# Altium schematic sheet Encoder_Interface.SchDoc
size A4; CompanyName: Technische Hochschule Nürnberg Georg Simon Ohm; Organization: UltraZohm; Address1: Kesslerplatz 12; Address2: 90489 Nürnberg; Address3: GERMANY; Website: www.ultrazohm.com
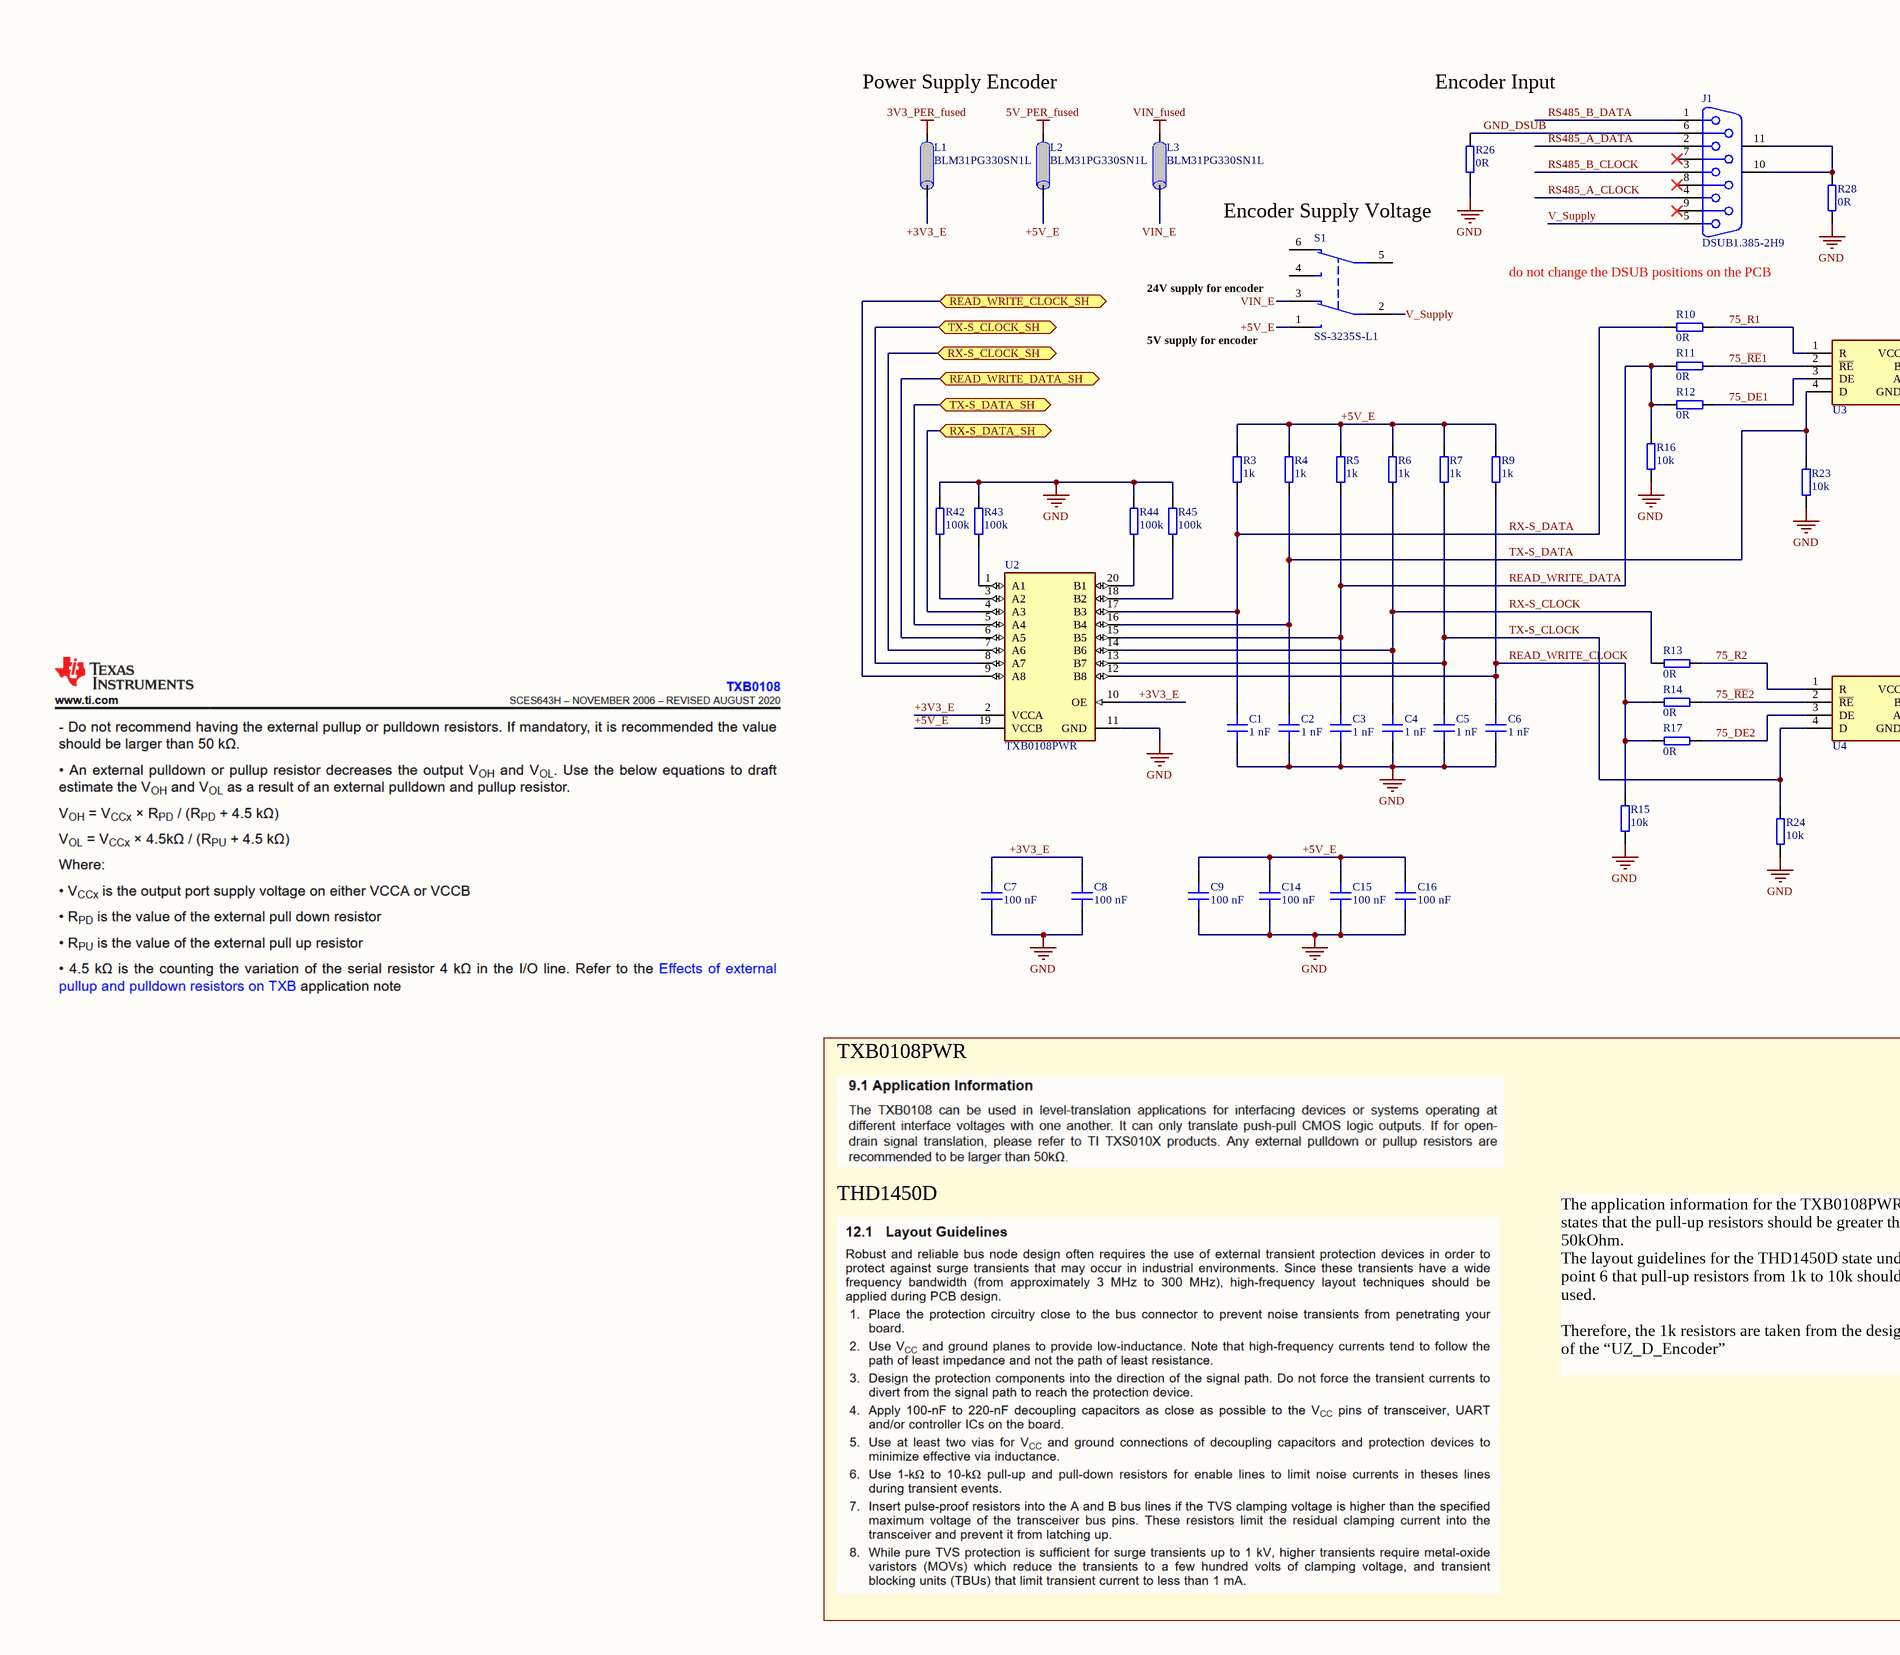
[diagram p0: Encoder_Interface.SchDoc, left]
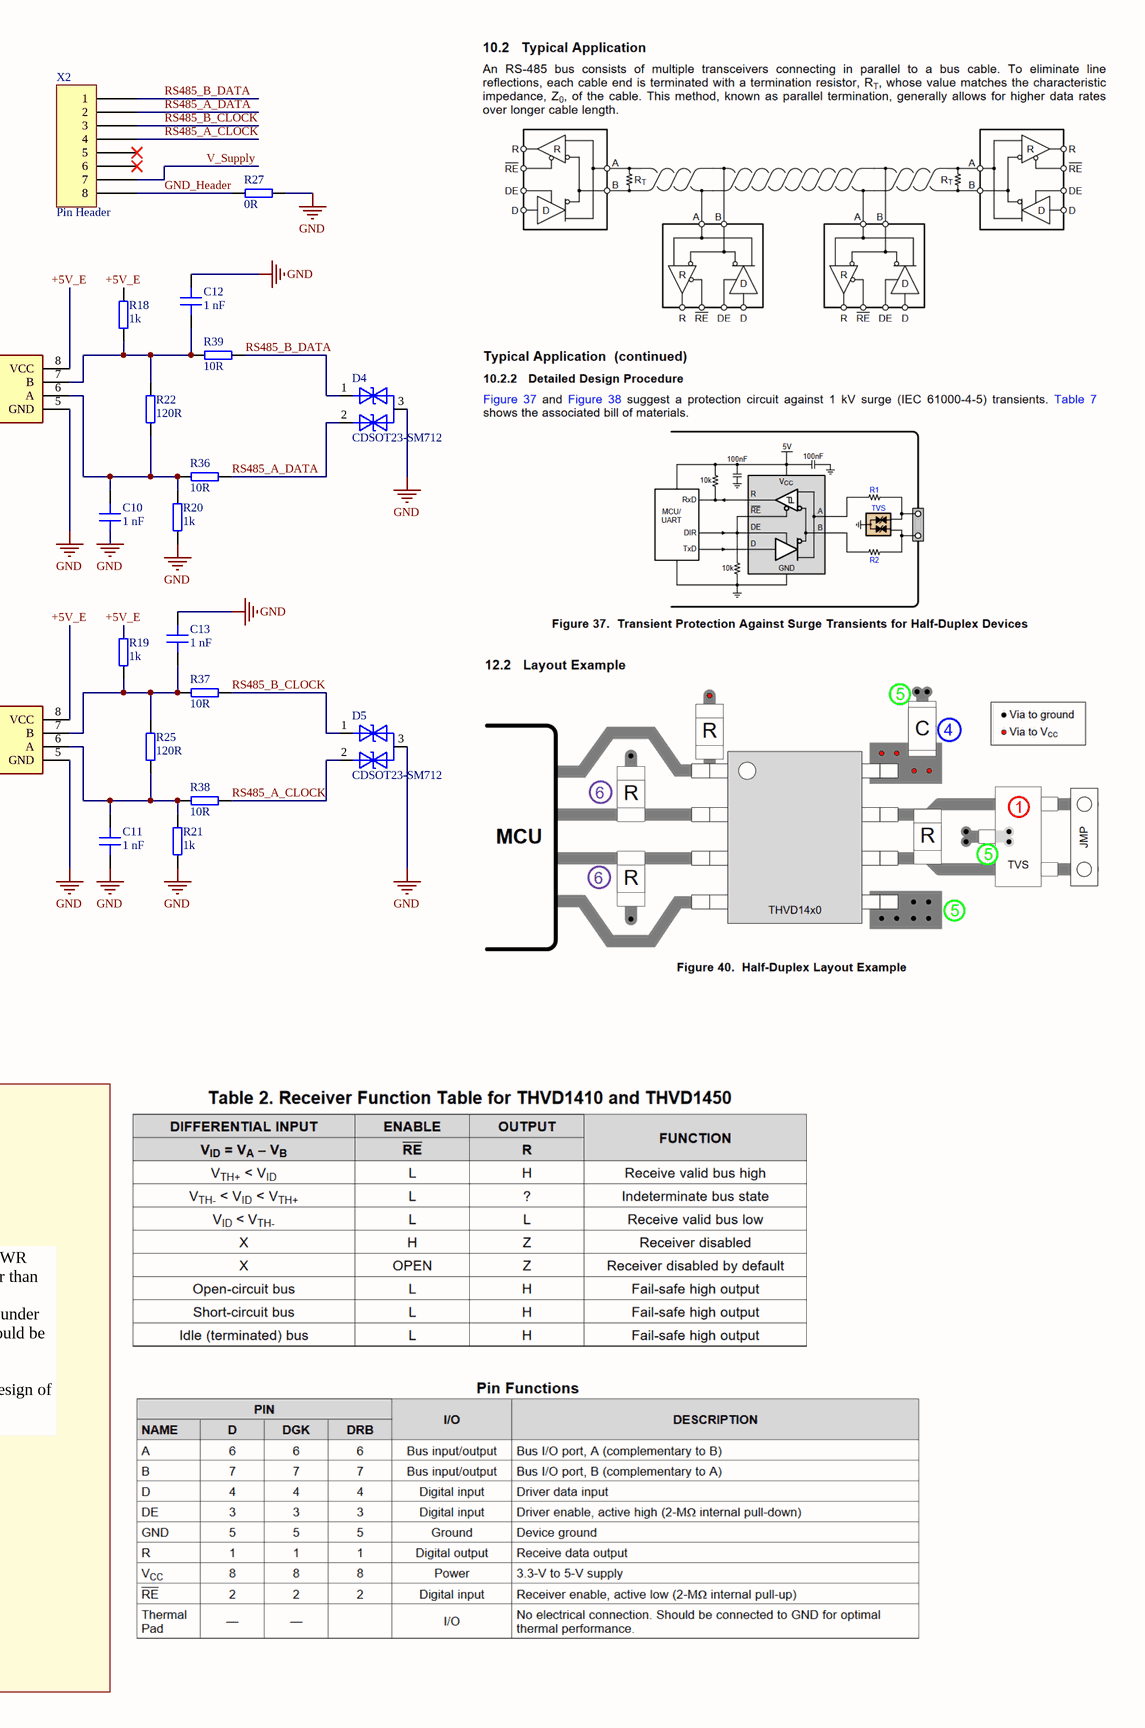
[diagram p1: Encoder_Interface.SchDoc, right]

## Parts
C1  1 nF  [C_0603]
C2  1 nF  [C_0603]
C3  1 nF  [C_0603]
C4  1 nF  [C_0603]
C5  1 nF  [C_0603]
C6  1 nF  [C_0603]
C7  100 nF  [C_0603]
C8  100 nF  [C_0603]
C9  100 nF  [C_0603]
C10  1 nF  [C_0603]
C11  1 nF  [C_0603]
C12  1 nF  [C_0603]
C13  1 nF  [C_0603]
C14  100 nF  [C_0603]
C15  100 nF  [C_0603]
C16  100 nF  [C_0603]
D4  CDSOT23-SM712  [SOT95P230X117-3N]
D5  CDSOT23-SM712  [SOT95P230X117-3N]
J1  DSUB1.385-2H9  [DSUB1.385-2H9]
L1  BLM31PG330SN1L  [IND 1206_3216]
L2  BLM31PG330SN1L  [IND 1206_3216]
L3  BLM31PG330SN1L  [IND 1206_3216]
R3  1k  [RES 0603_1608]
R4  1k  [RES 0603_1608]
R5  1k  [RES 0603_1608]
R6  1k  [RES 0603_1608]
R7  1k  [RES 0603_1608]
R9  1k  [RES 0603_1608]
R10  0R  [RES 0603_1608]
R11  0R  [RES 0603_1608]
R12  0R  [RES 0603_1608]
R13  0R  [RES 0603_1608]
R14  0R  [RES 0603_1608]
R15  10k  [RES 0603_1608]
R16  10k  [RES 0603_1608]
R17  0R  [RES 0603_1608]
R18  1k  [RES 0603_1608]
R19  1k  [RES 0603_1608]
R20  1k  [RES 0603_1608]
R21  1k  [RES 0603_1608]
R22  120R  [RES 0603_1608]
R23  10k  [RES 0603_1608]
R24  10k  [RES 0603_1608]
R25  120R  [RES 0603_1608]
R26  0R  [RES 0603_1608]
R27  0R  [RES 0603_1608]
R28  0R  [RES 0603_1608]
R36  10R  [RES 0603_1608]
R37  10R  [RES 0603_1608]
R38  10R  [RES 0603_1608]
R39  10R  [RES 0603_1608]
R42  100k  [RES 0603_1608]
R43  100k  [RES 0603_1608]
R44  100k  [RES 0603_1608]
R45  100k  [RES 0603_1608]
S1  SS-3235S-L1  [SS-3235S-L1]
U2  TXB0108PWR  [SOP65P640X120-20N]
U3  THVD1450DR  [SOIC127P600X175-8N]  (value not drawn)
U4  THVD1450DR  [SOIC127P600X175-8N]  (value not drawn)
X2  Pin Header  [HDR1X8]

## Ports
READ_WRITE_CLOCK_SH (bidir), READ_WRITE_DATA_SH (bidir), RX-S_CLOCK_SH (bidir), RX-S_DATA_SH (bidir), TX-S_CLOCK_SH (bidir), TX-S_DATA_SH (bidir)

## Nets
3V3_PER_fused: L1.1
5V_PER_fused: L2.1
GND: C1.1 C2.1 C3.1 C4.1 C5.1 C6.1 C7.1 C8.1 C9.1 C10.1 C11.1 C12.2 C13.2 C14.1 C15.1 C16.1 D4.3(A) D5.3(A) R15.1 R16.1 R20.1 R21.1 R23.1 R24.1 R26.2 R27.2 R28.1 R42.2 R43.2 R44.2 R45.2 U2.11(GND) U3.5(GND) U4.5(GND)
VIN_fused: L3.1
75_DE1: R12.2 U3.3(DE)
75_DE2: R17.2 U4.3(DE)
75_R1: R10.2 U3.1(R)
75_R2: R13.2 U4.1(R)
75_~{RE}1: R11.2 U3.2(~{RE})
75_~{RE}2: R14.2 U4.2(~{RE})
+3V3_E: C7.2 C8.2 L1.2 U2.2(VCCA) U2.10(OE)
+5V_E: C9.2 C14.2 C15.2 C16.2 L2.2 R3.2 R4.2 R5.2 R6.2 R7.2 R9.2 R18.2 R19.2 S1.1(NO1) U2.19(VCCB) U3.8(VCC) U4.8(VCC)
GND_DSUB: J1.6 R26.1
GND_Header: R27.1 X2.8
READ_WRITE_CLOCK: C6.2 R9.1 R14.1 R15.2 R17.1 U2.12(B8)
READ_WRITE_CLOCK_SH: U2.9(A8) ; port READ_WRITE_CLOCK_SH
READ_WRITE_DATA: C3.2 R5.1 R11.1 R12.1 R16.2 U2.15(B5)
READ_WRITE_DATA_SH: U2.6(A5) ; port READ_WRITE_DATA_SH
RS485_A_CLOCK: D5.2(K2) J1.4 R38.2 X2.4
RS485_A_DATA: D4.2(K2) J1.2 R36.2 X2.2
RS485_B_CLOCK: D5.1(K1) J1.3 R37.2 X2.3
RS485_B_DATA: D4.1(K1) J1.1 R39.2 X2.1
RX-S_CLOCK: C4.2 R6.1 R13.1 U2.14(B6)
RX-S_CLOCK_SH: U2.7(A6) ; port RX-S_CLOCK_SH
RX-S_DATA: C1.2 R3.1 R10.1 U2.17(B3)
RX-S_DATA_SH: U2.4(A3) ; port RX-S_DATA_SH
TX-S_CLOCK: C5.2 R7.1 R24.2 U2.13(B7) U4.4(D)
TX-S_CLOCK_SH: U2.8(A7) ; port TX-S_CLOCK_SH
TX-S_DATA: C2.2 R4.1 R23.2 U2.16(B4) U3.4(D)
TX-S_DATA_SH: U2.5(A4) ; port TX-S_DATA_SH
V_Supply: J1.5 S1.2(COM1) X2.7
VIN_E: L3.2 S1.3(NC1)
NetC10_2: C10.2 R20.2 R22.1 R36.1 U3.6(A)
NetC11_2: C11.2 R21.2 R25.1 R38.1 U4.6(A)
NetC12_1: C12.1 R18.1 R22.2 R39.1 U3.7(B)
NetC13_1: C13.1 R19.1 R25.2 R37.1 U4.7(B)
NetJ1_10: J1.10(MH1) J1.11(MH2) R28.2
NetR42_1: R42.1 U2.3(A2)
NetR43_1: R43.1 U2.1(A1)
NetR44_1: R44.1 U2.20(B1)
NetR45_1: R45.1 U2.18(B2)

Not connected (* = marked no-connect by the designer): J1 7* 8* 9*; S1 4(NO2) 5(COM2) 6(NC2); X2 5* 6*

## Notes on the sheet
- Power Supply Encoder
- Encoder Input
- Encoder Supply Voltage
- (near S1) 24V supply for encoder
- do not change the DSUB positions on the PCB
- (near S1) 5V supply for encoder
- TXB0108PWR
- THD1450D
- The application information for the TXB0108PWR states that the pull-up resistors should be greater than 50kOhm.
  The layout guidelines for the THD1450D state under point 6 that pull-up resistors from 1k to 10k should be used.
  Therefore, the 1k resistors are taken from the design of the “UZ_D_Encoder”
- Title
- Revision:
- Design Engineer:
- Date:
- Project:
- Sheet
- of

## Library data of the parts
C1-C6 C10-C13 = 06035A102JAT2A: Capacitor 0603, 50 VDC, 1 nF, C0G; Manufacturer: AVX; Tolerance: 5 %; Voltage Rating: 50 VDC; Created from: MGremer; Manufacturer Part Number: 06035A102JAT2A; PartID: 57; Created On: 20.12.2020 13:54:13; ComponentLink1Description: Datasheet; ComponentLink1URL: https://www.mouser.de/datasheet/2/40/C0GNP0_Dielectric-951274.pdf; Component Type: Capacitor 0603; Device Package: 0603; Last Updated: 15.02.2023 13:44:24; Mounting Type: SMD; Operating Temperature: -55 - 125°C; Series: C0G; Supplier 1: Mouser; Supplier Part Number 1: 581-06035A102J; Type: Capacitor; Value: 1 nF; Live Cycle Status: 1; LCSC Part Number: C106246; Stock number: not stored
C7-C9 C14-C16 = CC0603KRX7R9BB104: Capacitor 0603, 50 VDC, 100 nF, X7R; Manufacturer: YAGEO; Tolerance: 10 %; Voltage Rating: 50 VDC; Created from: AGeiger; Manufacturer Part Number: CC0603KRX7R9BB104; PartID: 102; Created On: 22.08.2022 14:35:53; ComponentLink1Description: Datasheet; ComponentLink1URL: https://datasheet.lcsc.com/lcsc/1809301912_YAGEO-CC0603KRX7R9BB104_C14663.pdf; Component Type: Capacitor 0603; Device Package: 0603; Last Updated: 22.08.2022 14:35:53; Mounting Type: SMD; Operating Temperature: -55 - 125°C; Series: X7R; Supplier 1: LCSC; Supplier Part Number 1: C14663; Supplier 2: Mouser; Supplier Part Number 2: 603-CC603KRX7R9BB104; Type: Capacitor; Value: 100 nF; Live Cycle Status: 1; LCSC Part Number: C14663
D4 D5 = CDSOT23-SM712: TVS Diode 7V; Manufacturer: Bourns; Polarity: Bidirectional; Type: TVS-Diode; Created from: MGremer; Category: tvs; Manufacturer Part Number: CDSOT23-SM712; Package: SOT-23; Supplier 1: Mouser; Supplier Part Number 1: 652-CDSOT23-SM712; Mounting Style: SMT; Pins: 3; Voltage: 7V; Created: 2020_09_21_MGremer; PartID: 7; Created On: 05.03.2021 11:12:07; ComponentLink1Description: Datasheet; ComponentLink1URL: https://www.mouser.de/datasheet/2/54/CDSOT23-SM712-1635169.pdf; Component Type: TVS Diode, ESD; Device Package: SOT-23-3; Last Updated: 23.11.2021 12:39:30; Mounting Type: SMD; Operating Temperature: -55 - 150°C; Series: CDSOT23-SM712; Value: 7V; Live Cycle Status: 1; Stock number: not stored
J1 = DSUB1.385-2H9: Connector; D Subminiature; 9 Position; Right Angle; Pitch 1.385 mm; Manufacturer: TE Connectivity; PackageDocument: O; Positions: 9; Gender: Receptacle; Created from: MHlatky; Published: 15-Jun-2001; LatestRevisionDate: 17-Jul-2002; LatestRevisionNote: Re-released for DXP Platform.; DatasheetDocument: 1-Sep-1999; PackageReference: 788750; Publisher: Altium Limited; Orientation: Right Angle; Manufacturer Part Number: DSUB1.385-2H9; PartID: 5; Created On: 26.01.2021 09:19:51; ComponentLink1Description: Datasheet; ComponentLink1URL: https://www.mouser.de/datasheet/2/418/7/ENG_CD_2311765_D-2072985.pdf; Component Type: DSUB Connector; Device Package: -; Last Updated: 27.05.2022 15:54:50; Type: DSUB Connector; Live Cycle Status: 1; Stock number: not stored; Supplier 1: Mouser; Supplier Part Number 1: 571-2311765-1; LCSC Part Number: C141882
L1-L3 = BLM31PG330SN1L: 9mΩ ±25% 33Ω@100MHz 6A; Manufacturer: Murata Electronics; Value: 33ohms; Created from: TGaupp; Manufacturer Part Number: BLM31PG330SN1L; PartID: 27; Created On: 03.01.2025 10:28:25; ComponentLink1Description: Datasheet; ComponentLink1URL: https://www.lcsc.com/datasheet/lcsc_datasheet_2409292303_Murata-Electronics-BLM31PG330SN1L_C74090.pdf; Component Type: Ferrite Beads; Device Package: 1206; Last Updated: 03.01.2025 10:28:25; Mounting Type: SMD; Operating Temperature: -55°C to +125°C; Series: BLM31_SN; Supplier 1: Mouser; Supplier Part Number 1: 81-BLM31P330S; Supplier 2: LCSC	C74090; Supplier Part Number 2: LCSC	C74090; Type: Ferrite_Bead; DC current: 6A; Live Cycle Status: 1; LCSC Part Number: C74090; Stock number: not stored
R3-R7 R9 R18-R21 = 0603WAF1001T5E: SMD resistor E24 series; Manufacturer: UNI-ROYAL; Tolerance: 1%; Created from: AGeiger; Manufacturer Part Number: 0603WAF1001T5E; PartID: 74; Created On: 14.12.2020 16:17:14; ComponentLink1Description: Datasheet; ComponentLink1URL: https://datasheet.lcsc.com/lcsc/2206010130_UNI-ROYAL-Uniroyal-Elec-0603WAF1001T5E_C21190.pdf; Component Type: SMD resistor; Device Package: 0603; Last Updated: 25.08.2022 16:01:46; Mounting Type: SMD; Supplier 1: LCSC; Supplier Part Number 1: C21190; Type: Resistor; Value: 1k; Live Cycle Status: 1; Stock number: Labor SMD Container; LCSC Part Number: C21190
R10-R14 R17 R26-R28 = RC0603JR-070RL: SMD resistor E24 series; Manufacturer: YAGEO; Tolerance: 5%; Created from: MGremer; Manufacturer Part Number: RC0603JR-070RL; PartID: 1; Created On: 14.12.2020 16:17:14; ComponentLink1Description: Datasheet; ComponentLink1URL: https://www.mouser.de/datasheet/2/447/PYu-RC_Group_51_RoHS_L_10-1664068.pdf; Component Type: SMD resistor; Device Package: 0603; Last Updated: 04.03.2021 09:09:42; Mounting Type: SMD; Supplier 1: Mouser; Supplier Part Number 1: 603-RC0603JR-070RL; Supplier 2: LCSC; Supplier Part Number 2: C21189; Type: Resistor; Value: 0R; Live Cycle Status: 1; Stock number: Labor SMD Container; LCSC Part Number: C21189
R15 R16 R23 R24 = RK73B1JTTD103J: SMD resistor E24 series; Manufacturer: KOA Speer; Tolerance: 5%; Created from: MGremer; Manufacturer Part Number: RK73B1JTTD103J; PartID: 98; Created On: 14.12.2020 16:17:14; ComponentLink1Description: Datasheet; ComponentLink1URL: https://www.mouser.de/datasheet/2/219/RK73B-1825463.pdf; Component Type: SMD resistor; Device Package: 0603; Last Updated: 27.05.2022 14:04:22; Mounting Type: SMD; Supplier 1: Mouser; Supplier Part Number 1: 660-RK73B1JTTD103J; Type: Resistor; Value: 10k; Live Cycle Status: 1; Stock number: Labor SMD Container; LCSC Part Number: C25804
R22 R25 = RK73B1JTTD121J: SMD resistor E24 series; Manufacturer: KOA Speer; Tolerance: 5%; Created from: MGremer; Manufacturer Part Number: RK73B1JTTD121J; PartID: 52; Created On: 14.12.2020 16:17:14; ComponentLink1Description: Datasheet; ComponentLink1URL: https://www.mouser.de/datasheet/2/219/RK73B-1825463.pdf; Component Type: SMD resistor; Device Package: 0603; Last Updated: 27.05.2022 13:40:47; Mounting Type: SMD; Supplier 1: Mouser; Supplier Part Number 1: 660-RK73B1JTTD121J; Type: Resistor; Value: 120R; Live Cycle Status: 1; Stock number: Labor SMD Container; LCSC Part Number: C22787
R36-R39 = CRCW060310R0FKTA: SMD 1/10watt 10ohms 1%; Manufacturer: Vishay; Created from: TGaupp; Manufacturer Part Number: CRCW060310R0FKTA; PartID: 296; Created On: 28.08.2023 12:16:52; ComponentLink1Description: Datasheet; ComponentLink1URL: https://www.vishay.com/docs/20008/dcrcw.pdf; Component Type: SMD resistor; Device Package: 0603; Last Updated: 23.10.2023 10:02:03; Mounting Type: SMD; Supplier 1: Mouser; Supplier Part Number 1: 71-CRCW0603-10; Type: Resistor; Tolerance: 1 %; Value: 10R; Live Cycle Status: 1; Stock number: not stored; LCSC Part Number: C2091419
R42-R45 = RK73B1JTTD104J: SMD resistor E24 series; Manufacturer: KOA Speer; Tolerance: 5%; Created from: MGremer; Manufacturer Part Number: RK73B1JTTD104J; PartID: 122; Created On: 14.12.2020 16:17:14; ComponentLink1Description: Datasheet; ComponentLink1URL: https://www.mouser.de/datasheet/2/219/RK73B-1825463.pdf; Component Type: SMD resistor; Device Package: 0603; Last Updated: 27.05.2022 14:04:10; Mounting Type: SMD; Supplier 1: Mouser; Supplier Part Number 1: 660-RK73B1JTTD104J; Type: Resistor; Value: 100k; Live Cycle Status: 1; Stock number: Labor SMD Container; LCSC Part Number: C25803
S1 = SS-3235S-L1: 50mA Horizontal attachment DPDT 12V 12V 50mA 10,000 times Black SMD Slide Switches ROHS; Manufacturer: XKB Connection; Created from: AGeiger; Manufacturer Part Number: SS-3235S-L1; PartID: 49; Created On: 21.02.2024 17:10:55; ComponentLink1Description: Datasheet; ComponentLink1URL: https://www.lcsc.com/datasheet/lcsc_datasheet_2110111230_XKB-Connection-SS-3235S-L1_C500055.pdf; Component Type: Switch DPDT; Device Package: SMD; Last Updated: 23.08.2024 11:42:29; Mounting Type: SMD; Operating Temperature: -40 to +85 °C; Supplier 1: LCSC; Supplier Part Number 1: C500055; Type: Switch; Value: DPDT; Live Cycle Status: 1; LCSC Part Number: C500055
U2 = TXB0108PWR: Voltage Levels 8-Bit Bi-directional V-Level Translator; Manufacturer: Texas Instruments; Value: 3.6 - 5.5V; Created from: T.Gaupp; Manufacturer Part Number: TXB0108PWR; PartID: 11; Created On: 13.12.2024 11:01:59; ComponentLink1Description: Datasheet; ComponentLink1URL: https://www.ti.com/lit/ds/symlink/txb0108.pdf?ts=1734008122008&ref_url=https%253A%252F%252Fwww.mouser.de%252F; Component Type: Level Shifter; Device Package: TSSOP-20; Last Updated: 03.01.2025 11:10:35; Mounting Type: SMD; Operating Temperature: -40 to +85 °C; Series: TXB0108; Supplier 1: Mouser; Supplier Part Number 1: 595-TXB0108PWR; Supplier 2: LCSC; Supplier Part Number 2: C53406; Type: Level Shifter; Live Cycle Status: 1; Stock number: not stored; LCSC Part Number: C53406
U3 U4 = THVD1450DR: 3.3-V to 5-V RS-485 transceiver with +/-18-kV IEC ESD protection 8-SOIC -40 to 125; Manufacturer: Texas Instruments; Created from: TGaupp; Manufacturer Part Number: THVD1450DR; PartID: 11; Created On: 03.01.2025 12:54:38; ComponentLink1Description: Datasheet; ComponentLink1URL: https://www.ti.com/lit/ds/symlink/thvd1450.pdf?ts=1735896970492&ref_url=https%253A%252F%252Fwww.ti.com%252Fproduct%252FTHVD1450; Component Type: RS-485 transceiver; Device Package: SOIC-8; Last Updated: 03.01.2025 12:54:38; Minimum Order: 1; Mounting Type: SMD; Operating Temperature: -40 - 125 °C; Series: THVD1450; Supplier 1: Mouser; Supplier Part Number 1: 595-THVD1450DR; Supplier 2: LCSC; Supplier Part Number 2: C2671361; Type: Standard; Live Cycle Status: 1; Stock number: not stored; LCSC Part Number: C2671361
X2 = 103741-8: 8 Pin; Manufacturer: TE Connectivity; Created from: MHlatky; Manufacturer Part Number: 103741-8; PartID: 9; Created On: 22.11.2021 15:31:45; ComponentLink1Description: Datasheet; ComponentLink1URL: https://www.mouser.de/datasheet/2/427/VISH_S_A0003529023_1-2568887.pdf; Component Type: Pin Header; Last Updated: 21.03.2022 12:19:22; Supplier 1: Mouser; Supplier Part Number 1: 571-103741-8; Type: Pin Header; Live Cycle Status: 1; Stock number: not stored